# Altium schematic sheet ADC.SchDoc
size A4; SheetNumber: 6; SheetTotal: 7
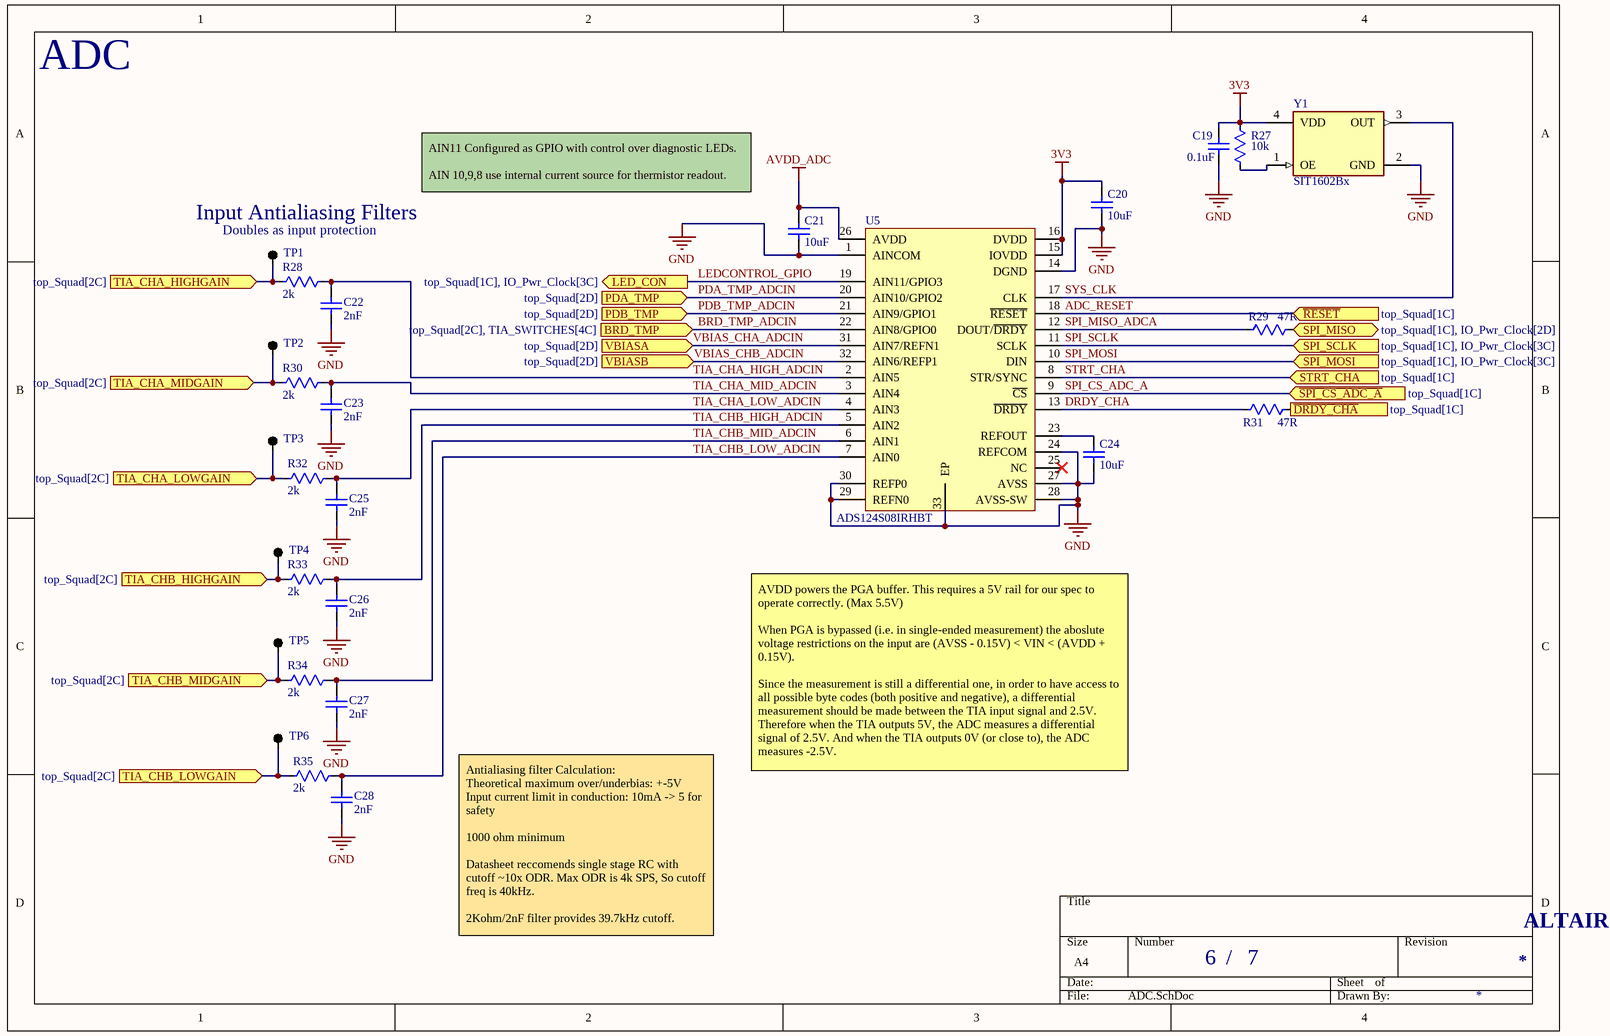
[diagram p0: ADC.SchDoc]

## Parts
C19  0.1uF  [CAP 0603 IPC MID DENSITY]
C20  10uF  [CAP 0805 IPC MID DENSITY]
C21  10uF  [CAP 0805 IPC MID DENSITY]
C22  2nF  [RES 0402 IPC MID DENSITY]
C23  2nF  [RES 0402 IPC MID DENSITY]
C24  10uF  [CAP 0805 IPC MID DENSITY]
C25  2nF  [RES 0402 IPC MID DENSITY]
C26  2nF  [RES 0402 IPC MID DENSITY]
C27  2nF  [RES 0402 IPC MID DENSITY]
C28  2nF  [RES 0402 IPC MID DENSITY]
R27  10k  [RES 0603 IPC MID DENSITY]
R28  2k  [RES 0402 IPC MID DENSITY]
R29  47R  [RES 0402 NON-IPC SEI]
R30  2k  [RES 0402 IPC MID DENSITY]
R31  47R  [RES 0402 NON-IPC SEI]
R32  2k  [RES 0402 IPC MID DENSITY]
R33  2k  [RES 0402 IPC MID DENSITY]
R34  2k  [RES 0402 IPC MID DENSITY]
R35  2k  [RES 0402 IPC MID DENSITY]
TP1  Testpoint  [TESTPOINT THT]  (value not drawn)  (no BOM)
TP2  Testpoint  [TESTPOINT THT]  (value not drawn)  (no BOM)
TP3  Testpoint  [TESTPOINT THT]  (value not drawn)  (no BOM)
TP4  Testpoint  [TESTPOINT THT]  (value not drawn)  (no BOM)
TP5  Testpoint  [TESTPOINT THT]  (value not drawn)  (no BOM)
TP6  Testpoint  [TESTPOINT THT]  (value not drawn)  (no BOM)
U5  ADS124S08IRHBT  [QFN50P500X500X100_HS-33L]
Y1  SIT1602Bx  [4PQFN NON-IPC SITIME]

## Ports
BRD_TMP (in, see top_Squad[2C], TIA_SWITCHES[4C]), LED_CON (out, see top_Squad[1C], IO_Pwr_Clock[3C]), PDA_TMP (in, see top_Squad[2D]), PDB_TMP (in, see top_Squad[2D]), SPI_MISO (bidir, see top_Squad[1C], IO_Pwr_Clock[2D]), SPI_MOSI (in, see top_Squad[1C], IO_Pwr_Clock[3C]), SPI_SCLK (in, see top_Squad[1C], IO_Pwr_Clock[3C]), STRT_CHA (in, see top_Squad[1C]), TIA_CHA_HIGHGAIN (in, see top_Squad[2C]), TIA_CHA_LOWGAIN (in, see top_Squad[2C]), TIA_CHA_MIDGAIN (in, see top_Squad[2C]), TIA_CHB_HIGHGAIN (in, see top_Squad[2C]), TIA_CHB_LOWGAIN (in, see top_Squad[2C]), TIA_CHB_MIDGAIN (in, see top_Squad[2C]), VBIASA (in, see top_Squad[2D]), VBIASB (in, see top_Squad[2D]), ~{DRDY_CHA} (out, see top_Squad[1C]), ~{RESET} (in, see top_Squad[1C]), ~{SPI_CS_ADC_A} (in, see top_Squad[1C])

## Nets
3V3: C19.2 C20.2 R27.2 U5.15(IOVDD) U5.16(DVDD) Y1.4(VDD)
AVDD_ADC: C21.2 U5.26(AVDD)
GND: C19.1 C20.1 C21.1 C22.1 C23.1 C24.1 C25.1 C26.1 C27.1 C28.1 U5.1(AINCOM) U5.14(DGND) U5.24(REFCOM) U5.27(AVSS) U5.28(AVSS-SW) U5.29(REFN0) U5.30(REFP0) U5.33(EP) Y1.2(GND)
~{DRDY_CHA}: R31.2 ; port ~{DRDY_CHA}
ADC_RESET: U5.18(~{RESET}) ; port ~{RESET}
BRD_TMP_ADCIN: U5.22(AIN8/GPIO0) ; port BRD_TMP
DRDY_CHA: R31.1 U5.13(~{DRDY})
LEDCONTROL_GPIO: U5.19(AIN11/GPIO3) ; port LED_CON
PDA_TMP_ADCIN: U5.20(AIN10/GPIO2) ; port PDA_TMP
PDB_TMP_ADCIN: U5.21(AIN9/GPIO1) ; port PDB_TMP
SPI_CS_ADC_A: U5.9(~{CS}) ; port ~{SPI_CS_ADC_A}
SPI_MISO: R29.2 ; port SPI_MISO
SPI_MISO_ADCA: R29.1 U5.12(DOUT/~{DRDY})
SPI_MOSI: U5.10(DIN) ; port SPI_MOSI
SPI_SCLK: U5.11(SCLK) ; port SPI_SCLK
STRT_CHA: U5.8(STR/SYNC) ; port STRT_CHA
SYS_CLK: U5.17(CLK) Y1.3(OUT)
TIA_CHA_HIGH_ADCIN: C22.2 R28.2 U5.2(AIN5)
TIA_CHA_HIGHGAIN: R28.1 TP1.1 ; port TIA_CHA_HIGHGAIN
TIA_CHA_LOW_ADCIN: C25.2 R32.2 U5.4(AIN3)
TIA_CHA_LOWGAIN: R32.1 TP3.1 ; port TIA_CHA_LOWGAIN
TIA_CHA_MID_ADCIN: C23.2 R30.2 U5.3(AIN4)
TIA_CHA_MIDGAIN: R30.1 TP2.1 ; port TIA_CHA_MIDGAIN
TIA_CHB_HIGH_ADCIN: C26.2 R33.2 U5.5(AIN2)
TIA_CHB_HIGHGAIN: R33.1 TP4.1 ; port TIA_CHB_HIGHGAIN
TIA_CHB_LOW_ADCIN: C28.2 R35.2 U5.7(AIN0)
TIA_CHB_LOWGAIN: R35.1 TP6.1 ; port TIA_CHB_LOWGAIN
TIA_CHB_MID_ADCIN: C27.2 R34.2 U5.6(AIN1)
TIA_CHB_MIDGAIN: R34.1 TP5.1 ; port TIA_CHB_MIDGAIN
VBIAS_CHA_ADCIN: U5.31(AIN7/REFN1) ; port VBIASA
VBIAS_CHB_ADCIN: U5.32(AIN6/REFP1) ; port VBIASB
NetC24_2: C24.2 U5.23(REFOUT)
NetR27_1: R27.1 Y1.1(OE)

Not connected (* = marked no-connect by the designer): U5 25(NC)*

## Notes on the sheet
- ADC
- (near TP1) Input Antialiasing Filters
- (near TP1) Doubles as input protection
- AIN11 Configured as GPIO with control over diagnostic LEDs.
  AIN 10,9,8 use internal current source for thermistor readout.
- AVDD powers the PGA buffer. This requires a 5V rail for our spec to operate correctly. (Max 5.5V)
  When PGA is bypassed (i.e. in single-ended measurement) the aboslute voltage restrictions on the input are (AVSS - 0.15V) < VIN < (AVDD + 0.15V).
  Since the measurement is still a differential one, in order to have access to all possible byte codes (both positive and negative), a differential measurement should be made between the TIA input signal and 2.5V. Therefore when the TIA outputs 5V, the ADC measures a differential signal of 2.5V. And when the TIA outputs 0V (or close to), the ADC measures -2.5V.
- Antialiasing filter Calculation:
  Theoretical maximum over/underbias: +-5V
  Input current limit in conduction: 10mA -> 5 for safety
  1000 ohm minimum
  Datasheet reccomends single stage RC with cutoff ~10x ODR. Max ODR is 4k SPS, So cutoff freq is 40kHz.
  2Kohm/2nF filter provides 39.7kHz cutoff.
- /
- ALTAIR PhotoDiode ReadOut (PDRO) - Squad

## Library data of the parts
C19 = CAP: Kemet C0603C104K5RACAUTO - Cap Ceramic 0.1uF 50V X7R 10% 0603 125C Paper T/R; MF: Kemet; MP: C0603C104K5RACAUTO
C20 C21 C24 = CAP: Murata GRM21BR61H106KE43L; MF: Murata; MP: Murata GRM21BR61H106KE43L
C22 C23 C25-C28 = CAP: Murata GCM1885C1H202FA16J 50V 2nF C0G ±1% 0603; MF: Murata; MP: GCM1885C1H202FA16J
R27 = RES: Vishay CRCW060310K0FKEA SMD 0603 10k, CRCW e3 Series, 75V, thick film, 100mW; MF: Vishay Dale; MP: CRCW060310K0FKEA
R28 R30 R32-R35 = RES: Panasonic ERJ-3EKF2001V Res Thick Film 0603 2K Ohm 1% 1/10W ±100ppm/°C; MF: Panasonic Electronic Components; MP: ERJ-3EKF2001V
R29 R31 = RES: Stackpole RMCF0402JT47R0 - Res 47Ohm 5% 0.063W 0402 Thick Film AEC-Q200 compliant; MF: Stackpole Electronics Inc.; MP: RMCF0402JT47R0
U5 = ADS124S08IRHBT: 24BIT ADC Delta-Sigma 4k samples/s PGA V-reference; Manufacturer 1: Texas Instruments; Manufacturer Part Number 1: ADS124S08IPBSR; Interface: SPI; Number of Inputs: 12; Number of Bits: 24; Sampling Rate: 4000S/s; Number of A/D Converters: 1; RoHS: No; Category: Analog to Digital Converters (ADCs); Stock 1: 2523; Mount: Surface Mount; Case/Package: LQFP; Number of Pins: 32; Min Operating Temperature: -50°C; Max Operating Temperature: 125°C; Packaging: Tape and Reel; ComponentLink1URL: http://www.ti.com/general/docs/lit/getliterature.tsp?genericPartNumber=ADS124S08&fileType=pdf&src-supplier=Farnell; ComponentLink1Description: http://www.ti.com/general/docs/lit/getliterature.tsp?genericPartNumber=ADS124S08&fileType=pdf&src-supplier=Farnell; ComponentLink2URL: http://www.ti.com/lit/ds/symlink/ads124s06.pdf?src-supplier=Digi-Key; ComponentLink2Description: http://www.ti.com/lit/ds/symlink/ads124s06.pdf?src-supplier=Digi-Key; Supplier 1: Digi-Key; Supplier Part Number 1: 296-45170-1-ND
Y1 = SIT1602Bx: MEMS OSC XO 4.096MHZ H/LVCMOS; Max Supply Current: 4.5mA; MF: SiTime; MP: SiT1602BC-21-XXN-4.096000; RoHS Compliant: Yes; Width: 0.098inch; Height: 0.032inch; Mount: Surface Mount; Series: SIT1602; Case/Package: SMD/SMT